# EAGLE schematic 1022 (EAGLE 7.4.0)
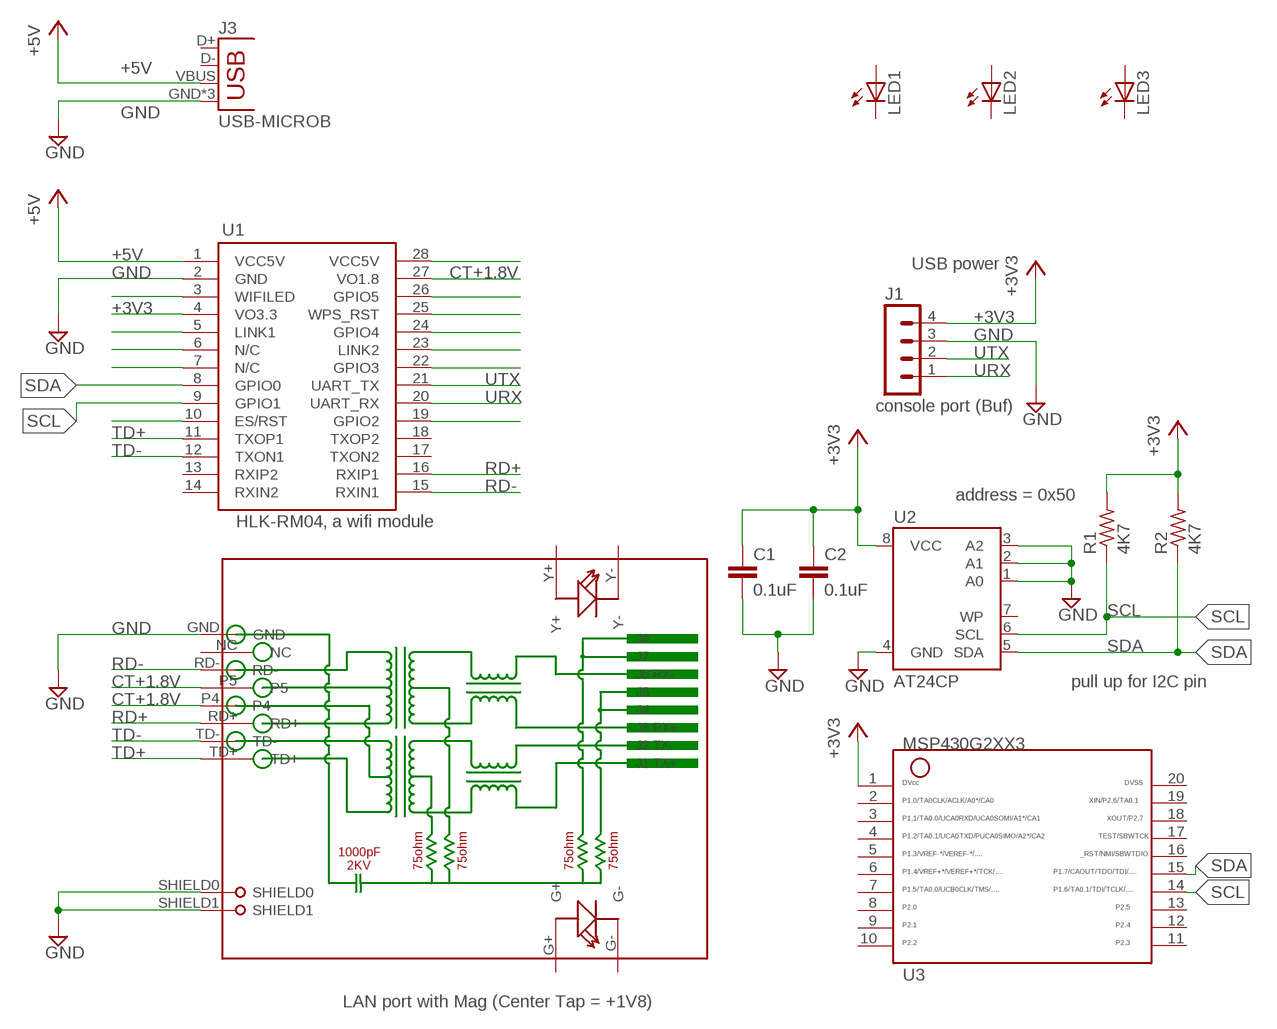
[diagram p0: schematic, sheet 1]

## Parts
C1  0.1uF  C-EUC0603  [C0603]
C2  0.1uF  C-EUC0603  [C0603]
J1  MA04-1  [MA04-1]
J2  HR911105A  [HR911105A]
J3  USB-MICROB  [USB-MICROB]
LED1  LED3MM  [LED3MM]
LED2  LED3MM  [LED3MM]
LED3  LED3MM  [LED3MM]
R1  4K7  R-US_R0603  [R0603]
R2  4K7  R-US_R0603  [R0603]
U1  HLK-RM04  [HLK-RM04]
U2  AT24CP  [DIL08]
U3  G2XX3---PW20  [PW20]

## Nets
+3V3: C1.1 C2.1 J1.4 R1.2 R2.2 U1.4(VO3.3) U2.8(VCC) U3.1
+5V: J3.VBUS U1.1(VCC5V)
CT+1.8V: J2.P4 J2.P5 U1.27(VO1.8)
GND: C1.2 C2.2 J1.3 J2.GND J2.SHIELD0 J2.SHIELD1 J3.GND J3.MT1(GND) J3.MT2(GND) U1.2(GND) U2.1(A0) U2.2(A1) U2.3(A2) U2.4(GND)
N$1: U1.3(WIFILED)
N$3: U1.5(LINK1)
N$4: U1.6(N/C)
N$5: U1.7(N/C)
N$8: U1.10(ES/RST)
N$17: U1.19(GPIO2)
N$20: U1.22(GPIO3)
N$21: U1.23(LINK2)
N$22: U1.24(GPIO4)
N$23: U1.25(WPS_RST)
N$24: U1.26(GPIO5)
N$26: U1.28(VCC5V)
RD+: J2.RD+ U1.16(RXIP1)
RD-: J2.RD- U1.15(RXIN1)
SCL: R1.1 U1.9(GPIO1) U2.6(SCL) U3.14
SDA: R2.1 U1.8(GPIO0) U2.5(SDA) U3.15
TD+: J2.TD+ U1.11(TXOP1)
TD-: J2.TD- U1.12(TXON1)
URX: J1.1 U1.20(UART_RX)
UTX: J1.2 U1.21(UART_TX)
Unconnected: J2.G+ J2.G- J2.NC J2.Y+ J2.Y- J3.D+ J3.D- LED1.A LED1.K(C) LED2.A LED2.K(C) LED3.A LED3.K(C) U1.13(RXIP2) U1.14(RXIN2) U1.17(TXON2) U1.18(TXOP2) U2.7(WP) U3.2 U3.3 U3.4 U3.5 U3.6 U3.7 U3.8 U3.9 U3.10 U3.11 U3.12 U3.13 U3.16 U3.17 U3.18 U3.19 U3.20

## Notes on the sheet
- USB power
- console port (Buf)
- address = 0x50
- HLK-RM04, a wifi module
- pull up for I2C pin
- LAN port with Mag (Center Tap = +1V8)

## Library data of the parts
C1 C2 = rcl:C-EU: CAPACITOR, European symbol
J1 = con-lstb:MA04-1: PIN HEADER; OC_FARNELL: unknown; OC_NEWARK: unknown
J2 = clavis-eagle-pcb-build:HR911105A
J3 = clavis-eagle-pcb-build:USB: USB Connectors USB-B-PTH is fully proven SKU : PRT-00139/CONN-08278 USB-miniB is fully proven SKU : PRT-00587 USB-A-PCB is untested. USB-A-H is throughly reviewed, but untested. Spark Fun Electronics SKU : PRT-00437 USB-B-SMT is throughly reviewed, but untested. Needs silkscreen touching up. USB-A-S has not been used/tested USB-MB-H has not been used/tested USB-MICROB has been used. CONN-09505; PROD_ID: CONN-09505
LED1-LED3 = led:LED: LED OSRAM: - CHIPLED LG R971, LG N971, LY N971, LG Q971, LY Q971, LO R971, LY R971 LH N974, LH R974 LS Q976, LO Q976, LY Q976 LO Q996 - Hyper CHIPLED LW Q18S LB Q993, LB Q99A, LB R99A - SideLED LS A670, LO A670, LY A670, LG A670, LP A670 LB A673, LV A673, LT A673, LW A673 LH A674 LY A675 LS A676, LA A676, LO A676, LY A676, LW A676 LS A679, LY A679, LG A679 - Hyper Micro SIDELED® LS Y876, LA Y876, LO Y876, LY Y876 LT Y87S - SmartLED LW L88C, LW L88S LB L89C, LB L89S, LG L890 LS L89K, LO L89K, LY L89K LS L896, LA L896, LO L896, LY L896 - TOPLED LS T670, LO T670, LY T670, LG T670, LP T670 LSG T670, LSP T670, LSY T670, LOP T670, LYG T670 LG T671, LOG T671, LSG T671 LB T673, LV T673, LT T673, LW T673 LH T674 LS T676, LA T676, LO T676, LY T676, LB T676, LH T676, LSB T676, LW T676 LB T67C, LV T67C, LT T67C, LS T67K, LO T67K, LY T67K, LW E67C LS E67B, LA E67B, LO E67B, LY E67B, LB E67C, LV E67C, LT E67C LW T67C LS T679, LY T679, LG T679 LS T770, LO T770, LY T770, LG T770, LP T770 LB T773, LV T773, LT T773, LW T773 LH T774 LS E675, LA E675, LY E675, LS T675 LS T776, LA T776, LO T776, LY T776, LB T776 LHGB T686 LT T68C, LB T68C - Hyper Mini TOPLED® LB M676 - Mini TOPLED Santana® LG M470 LS M47K, LO M47K, LY M47K Source: http://www.osram.convergy.de LUXEON: - LUMILED® LXK2-PW12-R00, LXK2-PW12-S00, LXK2-PW14-U00, LXK2-PW14-V00 LXK2-PM12-R00, LXK2-PM12-S00, LXK2-PM14-U00 LXK2-PE12-Q00, LXK2-PE12-R00, LXK2-PE12-S00, LXK2-PE14-T00, LXK2-PE14-U00 LXK2-PB12-K00, LXK2-PB12-L00, LXK2-PB12-M00, LXK2-PB14-N00, LXK2-PB14-P00, LXK2-PB14-Q00 LXK2-PR12-L00, LXK2-PR12-M00, LXK2-PR14-Q00, LXK2-PR14-R00 LXK2-PD12-Q00, LXK2-PD12-R00, LXK2-PD12-S00 LXK2-PH12-R00, LXK2-PH12-S00 LXK2-PL12-P00, LXK2-PL12-Q00, LXK2-PL12-R00 Source: www.luxeon.com KINGBRIGHT: KA-3528ASYC Source: www.kingbright.com
R1 R2 = rcl:R-US_: RESISTOR, American symbol
U1 = clavis-eagle-pcb-build:HLK-RM04
U2 = atmel:AT24C*: 2-wire serial EEPROM; MPN: AT24C1024BW-SH-B; OC_FARNELL: 1362646; OC_NEWARK: 03P2044
U3 = TI_MSP430_v16:G2XX3---PW20: MSP430G2XX1 TSSOP (PW) 20 Pin Package